# EAGLE design gdemu_ffc (EAGLE 9.6.1)
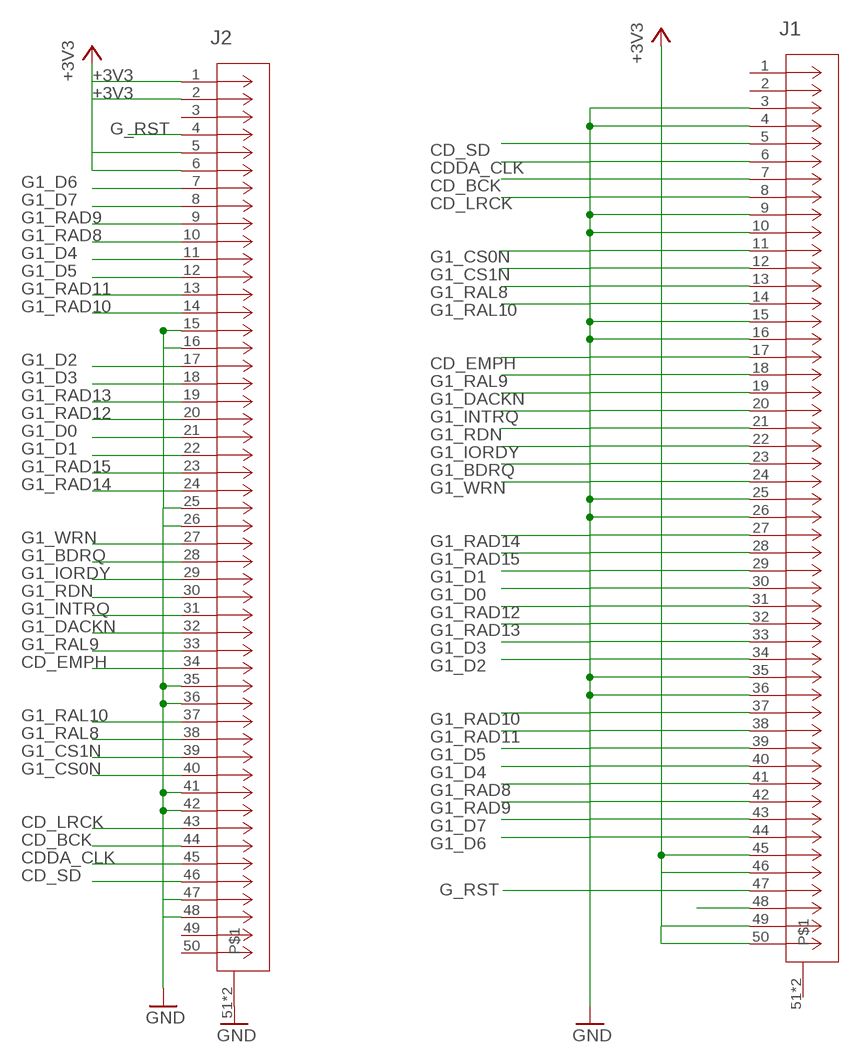
[diagram p0: schematic, sheet 1]

## Parts
J1  505110-5091  [CON01205_50_MOL]
J2  505110-5091  [CON01205_50_MOL]

## Nets
48: J1.48
+3V3: J1.45 J1.46 J1.49 J1.50 J2.1 J2.2 J2.5 J2.6
CD_BCK: J1.7 J2.44
CD_EMPH: J1.17 J2.34
CD_LRCK: J1.8 J2.43
CD_SD: J1.5 J2.46
CDDA_CLK: J1.6 J2.45
G1_BDRQ: J1.23 J2.28
G1_CS0N: J1.11 J2.40
G1_CS1N: J1.12 J2.39
G1_D0: J1.30 J2.21
G1_D1: J1.29 J2.22
G1_D2: J1.34 J2.17
G1_D3: J1.33 J2.18
G1_D4: J1.40 J2.11
G1_D5: J1.39 J2.12
G1_D6: J1.44 J2.7
G1_D7: J1.43 J2.8
G1_DACKN: J1.19 J2.32
G1_INTRQ: J1.20 J2.31
G1_IORDY: J1.22 J2.29
G1_RAD8: J1.41 J2.10
G1_RAD9: J1.42 J2.9
G1_RAD10: J1.37 J2.14
G1_RAD11: J1.38 J2.13
G1_RAD12: J1.31 J2.20
G1_RAD13: J1.32 J2.19
G1_RAD14: J1.27 J2.24
G1_RAD15: J1.28 J2.23
G1_RAL8: J1.13 J2.38
G1_RAL9: J1.18 J2.33
G1_RAL10: J1.14 J2.37
G1_RDN: J1.21 J2.30
G1_WRN: J1.24 J2.27
G_RST: J1.47 J2.4
GND: J1.3 J1.4 J1.9 J1.10 J1.15 J1.16 J1.25 J1.26 J1.35 J1.36 J2.15 J2.16 J2.25 J2.26 J2.35 J2.36 J2.41 J2.42 J2.47 J2.48 J2.51 J2.52
Unconnected: J1.1 J1.2 J1.51 J1.52 J2.3 J2.49 J2.50

## Library data of the parts
J1 J2 = personal:505110-5091; BUILT_BY: EMA_Don; COPYRIGHT: Copyright (C) 2016 Accelerated Designs. All rights reserved; MANUFACTURER_PART_NUMBER: 505110-5091; SOURCELIBRARY: Molex_2018-12-15; VENDOR: Molex Connector Corporation

## Board
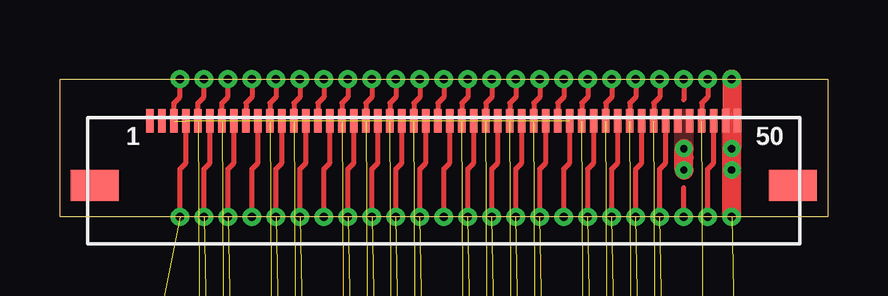
[diagram p1: board, top side]
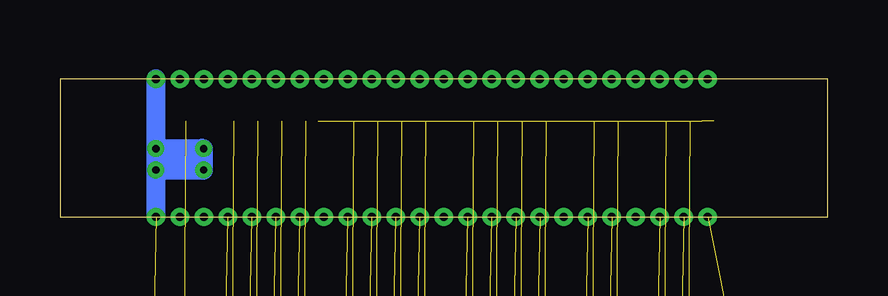
[diagram p2: board, bottom side, seen from below]

Size 32 x 5.75 mm. Coordinates in mm from the lower left corner, seen from the top.
Outline: 0,0 0,5.75 32,5.75 32,0 0,0
Copper layers (1*16): Top 0.035mm / dielectric 1.5mm / Bottom 0.035mm
Design rules "default *": minimum track width 6mil, minimum drill 0.34mm, track to track 6mil, track to pad 6mil, pad to pad 6mil, via to via 6mil, smd to smd 6mil, copper to edge 6mil, drill to drill 6mil, minimum pad ring 10mil, minimum via ring 8mil, stop-mask expansion 0mil, vias tented up to drill 0.349mm, thermal gap 10mil

### Footprints (pad centres in the part's own frame; a part is rotated, then mirrored left to right if it is on the bottom)
CON01205_50_MOL = smd 0.305 x 0.991: 1 -12.25,2.497; 2 -11.75,2.497; 3 -11.25,2.497; 4 -10.75,2.497; 5 -10.25,2.497; 6 -9.75,2.497; 7 -9.25,2.497; 8 -8.75,2.497; 9 -8.25,2.497; 10 -7.75,2.497; 11 -7.25,2.497; 12 -6.75,2.497; 13 -6.25,2.497; 14 -5.75,2.497; 15 -5.25,2.497; 16 -4.75,2.497; 17 -4.25,2.497; 18 -3.75,2.497; 19 -3.25,2.497; 20 -2.75,2.497; 21 -2.25,2.497; 22 -1.75,2.497; 23 -1.25,2.497; 24 -0.75,2.497; 25 -0.25,2.497; 26 0.25,2.497; 27 0.75,2.497; 28 1.25,2.497; 29 1.75,2.497; 30 2.25,2.497; 31 2.75,2.497; 32 3.25,2.497; 33 3.75,2.497; 34 4.25,2.497; 35 4.75,2.497; 36 5.25,2.497; 37 5.75,2.497; 38 6.25,2.497; 39 6.75,2.497; 40 7.25,2.497; 41 7.75,2.497; 42 8.25,2.497; 43 8.75,2.497; 44 9.25,2.497; 45 9.75,2.497; 46 10.25,2.497; 47 10.75,2.497; 48 11.25,2.497; 49 11.75,2.497; 50 12.25,2.497 | smd 2.007 x 1.295: 51 -14.55,-0.196; 52 14.55,-0.196

### Placement (x,y rotation side)
J1  16,1.51 0 top
J2  16.16,-17.14 180 top  (outside the outline)

### Tracks (layer width: path | path; a pad name or v marks a point on that pad's centre or on a via)
45  (via drill 0.35 pad 0.6)
  Top 0.203: v26,5.75 26,4.87
46  (via drill 0.35 pad 0.6)
  Top 0.203: v26,0 26,1.21
48  (via drill 0.35 pad 0.6)
  Top 0.203: v27,0 27,2 27.25,2.25 J1.48
+3V3  (via drill 0.3 pad 0.6, 0.35 pad 0.6)  (4 unrouted)
  Top 0.152: J1.45
  Top 0.203: J1.46
  Top 0.254: 26.25,2.7 26.01,2.46
  Top 0.8: v26.01,1.96 26.01,2.46 v26.01,2.85 | v28,5.75 v28,2.85 v28,1.96 v28,1.95 v28,0
  Bottom 0.8: v28,5.75 v28,2.85 | v28,2.85 v28,1.96 | v28,0 v28,1.95 v28,1.96 | v28,2.85 v26.01,2.85 | v28,1.96 v26.01,1.96 | v26.01,1.96 v26.01,2.85 | v26.01,2.85 26.16,2.85 27.05,1.96 v28,1.96 | v28,2.85 27.11,1.96 v26.01,1.96
  pour Top (no thermals): 26.4,2.88 26.4,4.4 arc90 26.3,4.5 25.7,4.5 arc90 25.61,4.41 25.61,2.87 26.39,2.87
  pour Top (no thermals): 28.39,2.88 28.39,4.4 arc90 28.29,4.5 27.69,4.5 arc90 27.6,4.41 27.6,2.87 28.38,2.87
CD_BCK  (via drill 0.35 pad 0.6)  (1 unrouted)
  Top 0.203: J1.7 6.75,4.75 7,5 v7,5.75
CD_EMPH  (via drill 0.35 pad 0.6)  (1 unrouted)
  Top 0.203: v12,5.75 12,5 11.75,4.75 J1.17
CD_LRCK  (via drill 0.35 pad 0.6)  (1 unrouted)
  Top 0.203: v7,0 7,2 7.25,2.25 J1.8
CD_SD  (via drill 0.35 pad 0.6)  (1 unrouted)
  Top 0.203: J1.5 5.75,4.75 6,5 v6,5.75
CDDA_CLK  (via drill 0.35 pad 0.6)  (1 unrouted)
  Top 0.203: v6,0 6,2 6.25,2.25 J1.6
G1_BDRQ  (via drill 0.35 pad 0.6)  (1 unrouted)
  Top 0.203: v15,5.75 15,5 14.75,4.75 J1.23
G1_CS0N  (via drill 0.35 pad 0.6)  (1 unrouted)
  Top 0.203: v9,5.75 9,5 8.75,4.75 J1.11
G1_CS1N  (via drill 0.35 pad 0.6)  (1 unrouted)
  Top 0.203: v9,0 9,2 9.25,2.25 J1.12
G1_D0  (via drill 0.35 pad 0.6)  (1 unrouted)
  Top 0.203: v18,0 18,2 18.25,2.25 J1.30
G1_D1  (via drill 0.35 pad 0.6)  (1 unrouted)
  Top 0.203: v18,5.75 18,5 17.75,4.75 J1.29
G1_D2  (via drill 0.35 pad 0.6)  (1 unrouted)
  Top 0.203: v20,0 20,2 20.25,2.25 J1.34
G1_D3  (via drill 0.35 pad 0.6)  (1 unrouted)
  Top 0.203: v20,5.75 20,5 19.75,4.75 J1.33
G1_D4  (via drill 0.35 pad 0.6)  (1 unrouted)
  Top 0.203: v23,0 23,2 23.25,2.25 J1.40
G1_D5  (via drill 0.35 pad 0.6)  (1 unrouted)
  Top 0.203: v23,5.75 23,5 22.75,4.75 J1.39
G1_D6  (via drill 0.35 pad 0.6)  (1 unrouted)
  Top 0.203: v25,0 25,2 25.25,2.25 J1.44
G1_D7  (via drill 0.35 pad 0.6)  (1 unrouted)
  Top 0.203: v25,5.75 25,5 24.75,4.75 J1.43
G1_DACKN  (via drill 0.35 pad 0.6)  (1 unrouted)
  Top 0.203: v13,5.75 13,5 12.75,4.75 J1.19
G1_INTRQ  (via drill 0.35 pad 0.6)  (1 unrouted)
  Top 0.203: v13,0 13,2 13.25,2.25 J1.20
G1_IORDY  (via drill 0.35 pad 0.6)  (1 unrouted)
  Top 0.203: v14,0 14,2 14.25,2.25 J1.22
G1_RAD8  (via drill 0.35 pad 0.6)  (1 unrouted)
  Top 0.203: v24,5.75 24,5 23.75,4.75 J1.41
G1_RAD9  (via drill 0.35 pad 0.6)  (1 unrouted)
  Top 0.203: v24,0 24,2 24.25,2.25 J1.42
G1_RAD10  (via drill 0.35 pad 0.6)  (1 unrouted)
  Top 0.203: v22,5.75 22,5 21.75,4.75 J1.37
G1_RAD11  (via drill 0.35 pad 0.6)  (1 unrouted)
  Top 0.203: v22,0 22,2 22.25,2.25 J1.38
G1_RAD12  (via drill 0.35 pad 0.6)  (1 unrouted)
  Top 0.203: v19,5.75 19,5 18.75,4.75 J1.31
G1_RAD13  (via drill 0.35 pad 0.6)  (1 unrouted)
  Top 0.203: v19,0 19,2 19.25,2.25 J1.32
G1_RAD14  (via drill 0.35 pad 0.6)  (1 unrouted)
  Top 0.203: v17,5.75 17,5 16.75,4.75 J1.27
G1_RAD15  (via drill 0.35 pad 0.6)  (1 unrouted)
  Top 0.203: v17,0 17,2 17.25,2.25 J1.28
G1_RAL8  (via drill 0.35 pad 0.6)  (1 unrouted)
  Top 0.203: v10,5.75 10,5 9.75,4.75 J1.13
G1_RAL9  (via drill 0.35 pad 0.6)  (1 unrouted)
  Top 0.203: v12,0 12,2 12.25,2.25 J1.18
G1_RAL10  (via drill 0.35 pad 0.6)  (1 unrouted)
  Top 0.203: v10,0 10,2 10.25,2.25 J1.14
G1_RDN  (via drill 0.35 pad 0.6)  (1 unrouted)
  Top 0.203: v14,5.75 14,5 13.75,4.75 J1.21
G1_WRN  (via drill 0.35 pad 0.6)  (1 unrouted)
  Top 0.203: v15,0 15,2 15.25,2.25 J1.24
G_RST  (via drill 0.35 pad 0.6)  (1 unrouted)
  Top 0.203: v27,5.75 27,5 26.75,4.75 J1.47
GND  (via drill 0.35 pad 0.6)  (21 unrouted)
  Top 0.203: v21,0 21,2 21.25,2.25 J1.36 | v21,5.75 21,5 20.75,4.75 J1.35 | v16,0 16,2 16.25,2.25 J1.26 | v16,5.75 16,5 15.75,4.75 J1.25 | v11,0 11,2 11.25,2.25 J1.16 | v11,5.75 11,5 10.75,4.75 J1.15 | v8,0 8,2 8.25,2.25 J1.10 | v8,5.75 8,5 7.75,4.75 J1.9 | v5,0 5,2 5.25,2.25 J1.4 | J1.3 4.75,4.75 5,5 v5,5.75

### Text on the board
tPlace: 1 | 50